# Altium schematic sheet Battery_Charging.SchDoc
size A4; SheetNumber: 4; SheetTotal: 4
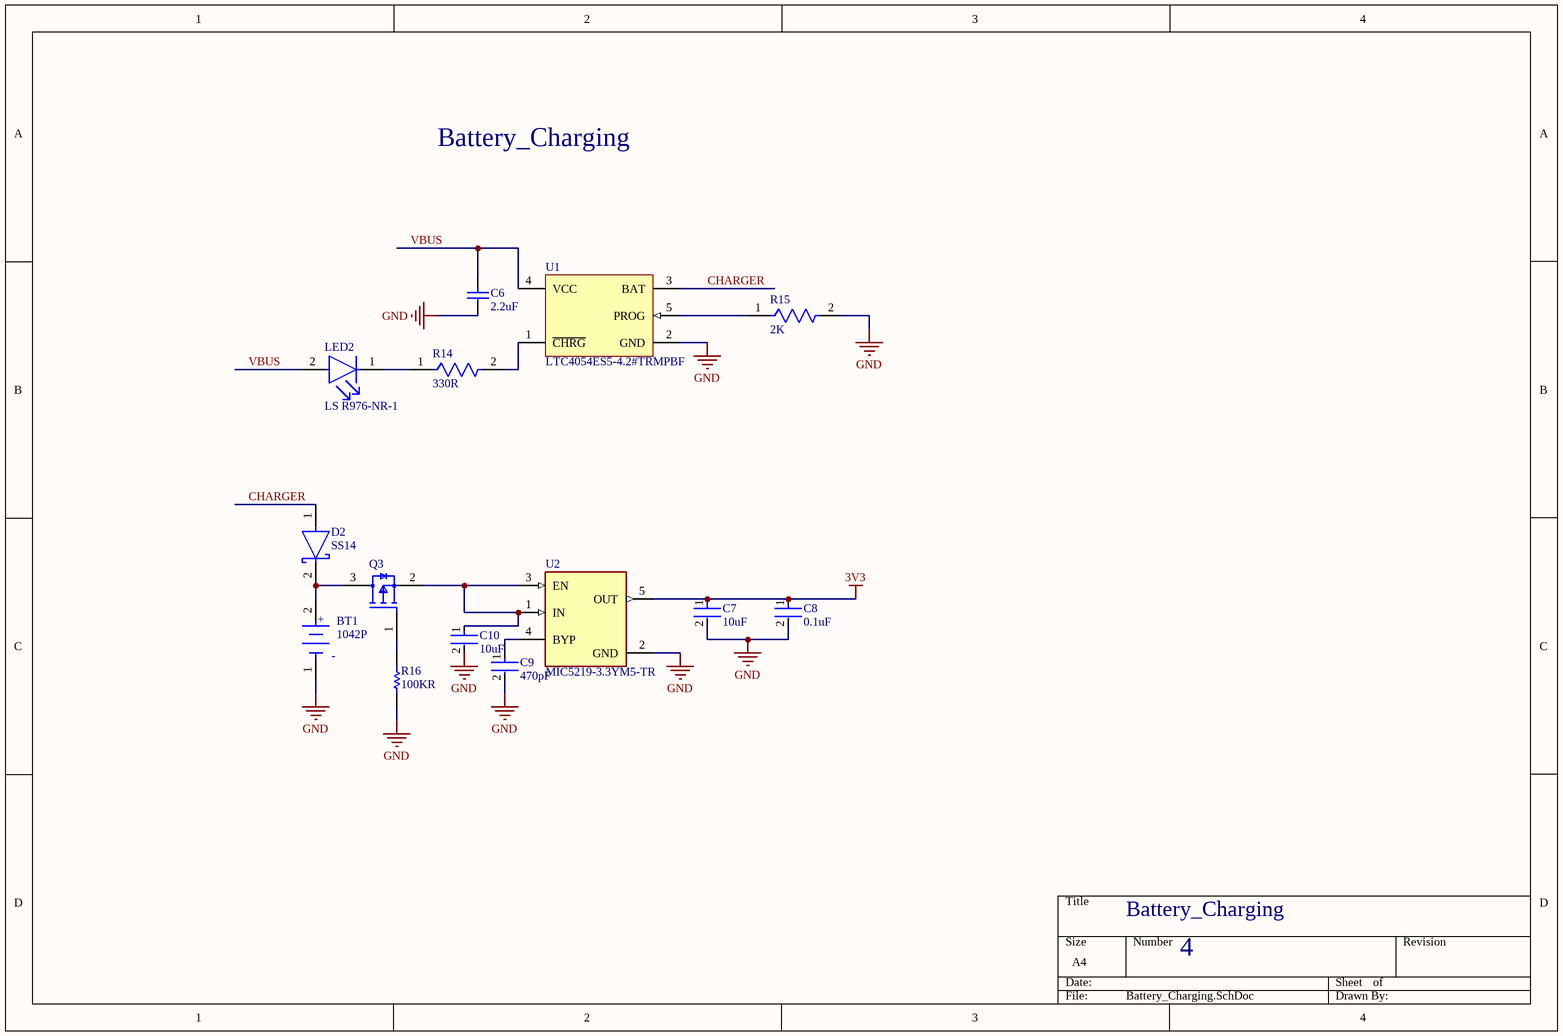
[diagram p0: Battery_Charging.SchDoc]

## Parts
BT1  1042P  [FP-1042P-MFG]
C6  2.2uF  [CAPC2013X145X50ML20T25]
C7  10uF  [FP-CL21-IPC_C]
C8  0.1uF  [FP-CC0805-EA-MFG]
C9  470pF  [FP-C0603C-CF-MFG]
C10  10uF  [FP-CL21-IPC_A]
D2  SS14  [FP-403AE-MFG]
LED2  LS R976-NR-1  [FP-LS_R976-MFG]
Q3  SI2301BDS-T1-GE3  [FP-S-03946-MFG]  (value not drawn)
R14  330R  [FP-CPF0603-MFG]
R15  2K  [FP-RMCF0603-IPC_A]
R16  100KR  [RESC2013X70X40ML20T20]
U1  LTC4054ES5-4.2#TRMPBF  [LT-S5-5-TSOT-23_M]
U2  MIC5219-3.3YM5-TR  [FP-SOT23-5LD-PL-1-IPC_C]

## Nets
3V3: C7.1 C8.1 U2.5(OUT)
GND: BT1.1(C) C6.1 C7.2 C8.2 C9.2 C10.2 R15.2 R16.2 U1.2(GND) U2.2(GND)
CHARGER: D2.1(A) U1.3(BAT)
VBUS: C6.2 LED2.2(A) U1.4(VCC)
NetBT1_2: BT1.2(A) D2.2(C) Q3.3(D)
NetC9_1: C9.1 U2.4(BYP)
NetC10_1: C10.1 Q3.2(S) U2.1(IN) U2.3(EN)
NetLED2_1: LED2.1(C) R14.1
NetQ3_1: Q3.1(G) R16.1
NetR14_2: R14.2 U1.1(~{CHRG})
NetR15_1: R15.1 U1.5(PROG)

## Notes on the sheet
- Battery_Charging
- 4
- (in symbol CMP-19636-000019-1) +; -

## Library data of the parts
BT1 = CMP-19636-000019-1: BATTERY HOLDER 18650 SMD TAB; Number of Cells: 1; Max Operating Temperature: 145°C; Termination: SMD/SMT; Mount: Surface Mount; Min Operating Temperature: -50°C; Package Quantity: 200; Packaging: Tray; Lead Free: Lead Free
C6 = CMP-1036-04819-2: Part Number: C0805C225K9PACTU; Manufacturer: Kemet
C7 = CMP-13271-000175-1: CL21 Series 0805 10uF 6.3V ±10% Tolerance X6S Multilayer Ceramic Chip Capacitor; Depth: 1.25mm; Mount: Surface Mount; Packaging: Tape and Reel; Radiation Hardening: No; Height: 1.25mm; Tolerance: 10%; Package Quantity: 1; Max Operating Temperature: 105°C; Voltage Rating (DC): 6.3V; Case Code (Metric): 2012; Width: 0.049inch; Case/Package: 0805; Voltage Rating: 6.3V; Min Operating Temperature: -55°C; Length: 2mm; Capacitance: 10uF; Lead Free: Lead Free; Thickness: 0.055inch; Case Code (Imperial): 0805; Dielectric: X6S
C8 = CMP-03422-000810-2: CAP CER X7R 0805; RoHS Compliant: Yes
C9 = CMP-03020-003327-1: CAP CER 470PF 10V X7R 0603; Manufacturer: KEMET; Manufacturer Part Number: C0603C471K8RACTU; Temperature Coefficient: 30ppm/°C; Tolerance: 0.1; Automotive Grade: Grade 1; Material: Ceramic; Mouser Description: Capacitor, Ceramic, 470Pf, 10Vdc, 10-% Tol, 10+% Tol, X7r-Tc Code, -15, 15%-Tc Rohs Compliant: Yes; Temperature Range Low: -55°C; Octopart: https://octopart.com/c0603c471k8ractu-kemet-9138956; Temperature Characteristic: X7R; ComponentLink2Description: Datasheet; Device Class L2: Capacitors; RoHS: TRUE; ComponentLink2URL: https://api.kemet.com/component-edge/download/datasheet/C0603C100J5GACAUTO.pdf; Capacitance: 470 pF; Automotive: Yes; Device Class L1: Passive Components; Temperature: -55°C to +125°C; Package: C0603C-CF; Lead Free: Yes; Height: 0.87mm; Device Class L3: Ceramic Capacitors; Digikey Description: CAP CER 470PF 10V X7R 0603; Category: Cap; Value: 470 pF; Voltage Rating: 10 V; Temperature Range High: +125°C
C10 = CMP-13271-001826-1: CL21 Series 0805 10uF 6.3V ±10% Tolerance X5R Multilayer Ceramic Chip Capacitor; Voltage Rating (DC): 6.3V; Thickness: 0.053inch; Min Operating Temperature: -55°C; Mount: Surface Mount; Max Operating Temperature: 85°C; Case Code (Metric): 2012; Dielectric: X5R; Length: 2mm; Case Code (Imperial): 0805; Radiation Hardening: No; Height: 1.25mm; Depth: 1.25mm; Contact Plating: Tin; Voltage Rating: 6.3V; Width: 0.049inch; Package Quantity: 1; Capacitance: 10uF; Packaging: Tape and Reel; Tolerance: 10%; Lead Free: Lead Free; Case/Package: 0805
D2 = CMP-2000-04943-2: DIODE SCHOTTKY 40V 1A SMA; Manufacturer: ON Semiconductor; Peak Reverse Current: 0.2mA; Max Junction Temp: +125°C; Standoff Height: 0.05mm; Max Surge Forward Current: 40A; Mouser Description: Schottky Diodes & Rectifiers SMA 40V 1.0A; RoHS: TRUE; Lead Free: Yes; Manufacturer Part Number: SS14; Device Class L3: Schottky Diodes; Category: Diode; Automotive: No; Digikey Description: DIODE SCHOTTKY 40V 1A SMA; ComponentLink2Description: Datasheet; Device Class L2: Diodes; Height: 2.5mm; Temperature Range High: +125°C; ComponentLink2URL: https://www.onsemi.com/pub/Collateral/SS19-D.PDF; Device Class L1: Discrete Semiconductors; Package: 403AE; Octopart: https://octopart.com/ss14-on+semiconductor-29205033; Max Repetitive Reverse Voltage: 40V; Temperature Range Low: -65°C; Forward Current: 1A; Temperature: -65°C to +125°C
LED2 = CMP-62016-000037-1: LED RED DIFFUSED 0805 SMD; Lens Size: 1.25mm; Number of LEDs: 1; Luminous Intensity: 180mcd; Dominant Wavelength: 633nm; Lens Style: Flat; Reverse Voltage: 12V; Lens Color: White; Forward Voltage: 2.5V; Forward Current: 25mA; Power Dissipation: 65W; Luminous Flux: 0.47lm; Test Current: 20mA; Viewing Angle: 160°; Length: 2mm; Number of Pins: 2; Lens Transparency: Diffused; Min Operating Temperature: -30°C; Case Code (Metric): 2012; Depth: 1.35mm; Color: Red; Illumination Color: Red; Max Operating Temperature: 85°C; Mount: Surface Mount; Case/Package: 0805; Height: 0.9mm; Package Quantity: 16000; Number of Elements: 1; Radiation Hardening: No; Case Code (Imperial): 0805; Packaging: Tape and Reel; Width: 1.25mm
Q3 = CMP-00030-42864886-1: SI2301BDS-T1-GE3 Trans Mosfet P-ch Si 20V 2.2A 3-PIN SOT-23 T/r / Mosfet P-ch 20V 2.2A SOT23-3; Rise Time: 40ns; Nominal Vgs: -950mV; Gate to Source Voltage (Vgs): 8V; Element Configuration: Single; Number of Channels: 1; Power Dissipation: 700mW; Resistance: 100MΩ; Continuous Drain Current (ID): -2.2A; Drain to Source Breakdown Voltage: -20V; Turn-On Delay Time: 20ns; Turn-Off Delay Time: 30ns; Input Capacitance: 375pF; Schedule B: 8541210080, 8541210080; Length: 3.04mm; Height: 1.02mm; Radiation Hardening: No; RoHS: Compliant; NexarPartId: 42864886; Number of Pins: 3; Weight: 1.437803g; Mount: Surface Mount; Min Operating Temperature: -55°C; Number of Elements: 1; Drain to Source Resistance: 100mΩ; Max Power Dissipation: 700mW; Threshold Voltage: -950mV; Lead Free: Lead Free; Rds On Max: 100mΩ; Width: 1.4mm; REACH SVHC: Unknown; Fall Time: 40ns; Max Operating Temperature: 150°C; Drain to Source Voltage (Vdss): -20V; Case/Package: SOT-23-3
R14 = CMP-03211-000699-1: RES SMD 330Ω 0.1% 1/16W 0603; Manufacturer: TE Connectivity; Manufacturer Part Number: CPF0603B330RE1; Voltage Rating: 50V; Temperature Coefficient: 25ppm/°C; Power Rating: 0.063W; Package: CPF0603; Ipc Land Pattern Name: RESC15580X45; Temperature: -55°C to +155°C; Value: 330Ω; Composition: Thin Film; Device Class L3: Chip SMD Resistors; Temperature Range High: +155°C; Resistance: 330Ω; Automotive: No; ComponentLink2URL: https://www.te.com/commerce/DocumentDelivery/DDEController?Action=showdoc&DocId=Data+Sheet%7F1773200%7FM%7Fpdf%7FEnglish%7FENG_DS_1773200_M.pdf%7F3-1676481-2; RoHS: TRUE; Series: CPF; Octopart: https://octopart.com/cpf0603b330re1-te+connectivity-9539413; Tolerance: 0.1%; octopart_url: https://octopart.com/cpf0603b330re1-te+connectivity-9539413; packaging: 1k Reel; Category: Res; Device Class L2: Resistors; Temperature Range Low: -55°C; ComponentLink2Description: Datasheet; Lead Free: Yes; Height: 0.55mm; Device Class L1: Passive Components
R15 = CMP-26527-006357-1: 2kΩ ±1% 0.1W 0603 Thick Film Chip Resistor AEC-Q200 compliant; Temperature Coefficient: 100ppm/°C; Max Power Dissipation: 100mW; Resistance: 2kR; Working Voltage: 75V; Resistor Type: Thick Film; Max Operating Temperature: 155°C; Depth: 0.8mm; Technology: THICK FILM; Case/Package: 0603; Tolerance: 1%; Packaging: Tape and Reel; Contact Plating: Tin; Case Code (Imperial): 0603; Radiation Hardening: No; Mount: Surface Mount; Features: Automotive AEC-Q200; RoHS Compliant: Yes; Military Standard: Not; Number of Terminations: 2; Height: 0.022inch; Width: 0.031inch; Series: RMCF; Lead Free: Lead Free; Length: 1.55mm; Min Operating Temperature: -55°C; Case Code (Metric): 1608; Construction: Rectangular; Power Rating: 100mW
R16 = CMP-2001-04377-1: Part Number: ERJ-6ENF1003V; Manufacturer: Panasonic
U1 = CMP-0471-00454-1: Standalone Linear Li-Ion Battery Charger with Thermal Regulation, 4.25 to 6.5 V Vin, 5-pin SOT23 (S5-5), -40 to 85 degC, Pb-Free, Mini Tape and Reel; Manufacturer: Linear Technology; Number of Cells: 1; Float Voltage: 4.2 V; Max Charge Current(A): 0.8; Vin Max(V): 6.5; Battery Chemistry: Li-Ion, Li-Polymer; Charge Termination: C/10; Vin Min(V): 4.25; ComponentLink1Description: Manufacturer URL; PackageReference: S5-5; ComponentLink1URL: http://www.linear.com/; ComponentLink3Description: Package Specification; Mounting Technology: Surface Mount; ComponentLink2URL: http://cds.linear.com/docs/en/datasheet/405442xf.pdf; Code_JEDEC: MO-193; Packing: Mini Tape and Reel; PartNumber: LTC4054ES5-4.2#TRMPBF; RoHS: TRUE; PackageDescription: 5-Pin Plastic TSOT-23, Body 1.63 x 2.90 mm, Pitch 0.95 mm; Type of Charger: Linear; PackageVersion: Jun-10; ComponentLink3URL: http://cds.linear.com/docs/en/packaging/SOT_5_05-08-1635.pdf; ComponentLink2Description: Datasheet
U2 = CMP-06324-000027-1: IC REG LINEAR 3.3V 500MA SOT23-5; Dropout Voltage: 350mV; Output Type: Fixed; Number of Regulators: 1; Max Input Voltage: 12V; Min Input Voltage: 2.5V; Min Operating Temperature: -40°C; Nominal Output Voltage: 3.3V; Output Voltage: 3.3V; Packaging: Cut Tape; Mount: Surface Mount; Number of Pins: 5; Case/Package: SOT-23-5; Lead Free: Lead Free; Max Operating Temperature: 125°C; REACH SVHC: No SVHC; Output Current: 500mA